# EAGLE design Pi_Observer (EAGLE 9.4.2)
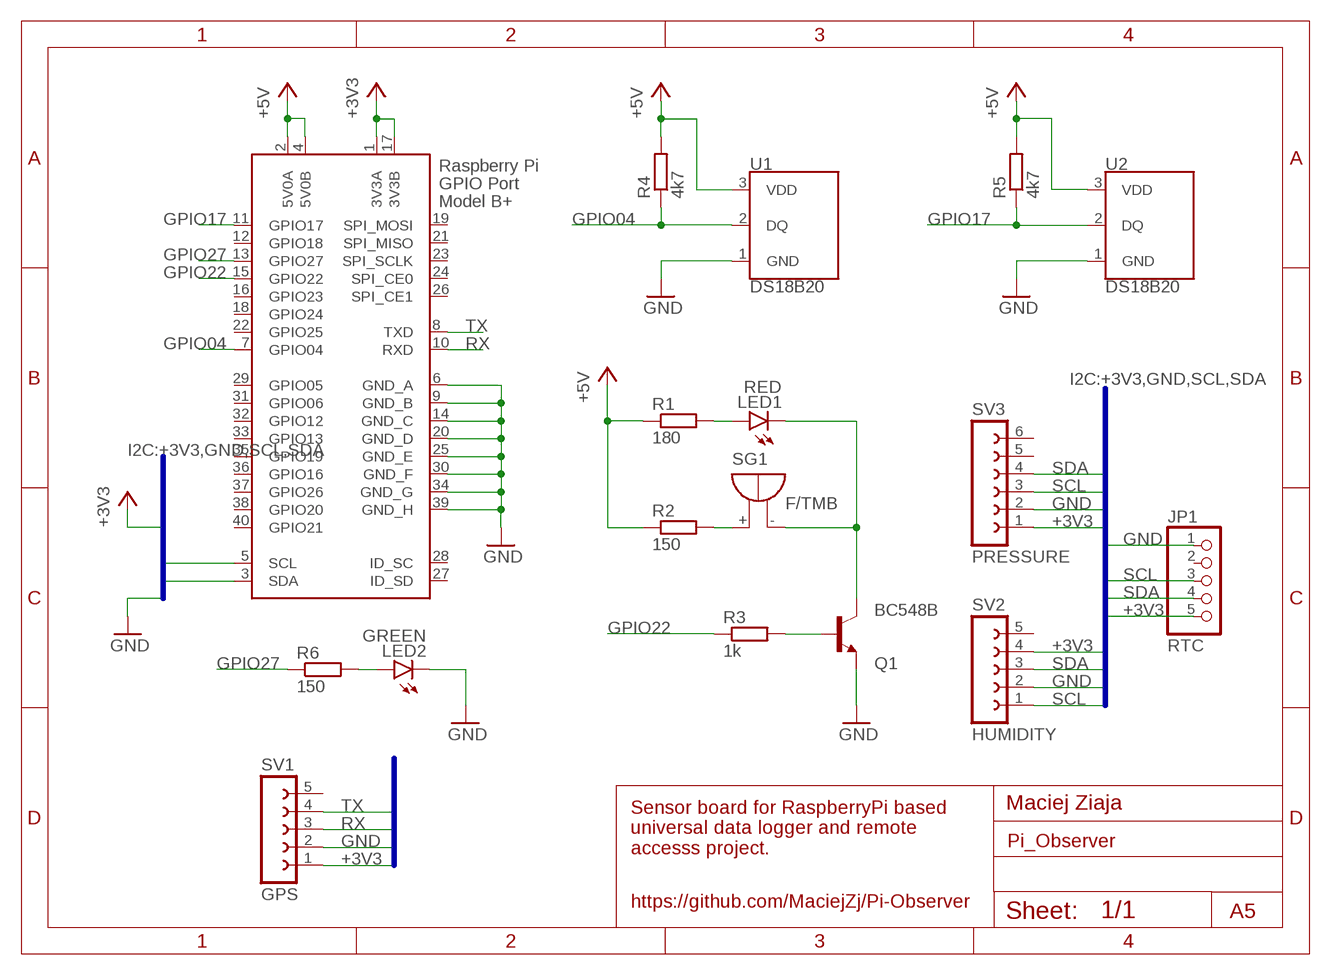
[diagram p0: schematic, sheet 1]

## Parts
JP1  RTC  PINHD-1X5  [1X05]
LED1  RED  LED5MM  [LED5MM]
LED2  GREEN  LED5MM  [LED5MM]
Q1  BC548B  [TO92-EBC]
R1  180  R-EU_M1206  [M1206]
R2  150  R-EU_M1206  [M1206]
R3  1k  R-EU_M1206  [M1206]
R4  4k7  R-EU_M1206  [M1206]
R5  4k7  R-EU_M1206  [M1206]
R6  150  R-EU_M1206  [M1206]
SG1  F/TMB  [F/TMB]
SV1  GPS  FE05-1  [FE05-1]
SV2  HUMIDITY  FE05-1  [FE05-1]
SV3  PRESSURE  FE06-1  [FE06]
U1  DS18B20  [TO-92-AMMO]
U2  DS18B20  [TO-92-AMMO]
X1  RASPI_GPIO_B+#_PIN  [RASPI_GPIO_B+_PIN]

## Nets
+3V3: JP1.5 SV1.1 SV2.4 SV3.1 X1.1(3V3A) X1.17(3V3B)
+5V: R1.1 R2.1 R4.2 R5.2 U1.3(VDD) U2.3(VDD) X1.2(5V0A) X1.4(5V0B)
GND: JP1.1 LED2.K(C) Q1.E SV1.2 SV2.2 SV3.2 U1.1(GND) U2.1(GND) X1.6(GND_A) X1.9(GND_B) X1.14(GND_C) X1.20(GND_D) X1.25(GND_E) X1.30(GND_F) X1.34(GND_G) X1.39(GND_H)
GPIO04: R4.1 U1.2(DQ) X1.7(GPIO04)
GPIO17: R5.1 U2.2(DQ) X1.11(GPIO17)
GPIO22: R3.1 X1.15(GPIO22)
GPIO27: R6.1 X1.13(GPIO27)
N$1: LED1.K(C) Q1.C SG1.-
N$2: R2.2 SG1.+
N$3: LED1.A R1.2
N$5: Q1.B R3.2
N$9: LED2.A R6.2
RX: SV1.3 X1.10(RXD)
SCL: JP1.3 SV2.1 SV3.3 X1.5(SCL)
SDA: JP1.4 SV2.3 SV3.4 X1.3(SDA)
TX: SV1.4 X1.8(TXD)
Unconnected: JP1.2 SV1.5 SV2.5 SV3.5 SV3.6 X1.12(GPIO18) X1.16(GPIO23) X1.18(GPIO24) X1.19(SPI_MOSI) X1.21(SPI_MISO) X1.22(GPIO25) X1.23(SPI_SCLK) X1.24(SPI_CE0) X1.26(SPI_CE1) X1.27(ID_SD) X1.28(ID_SC) X1.29(GPIO05) X1.31(GPIO06) X1.32(GPIO12) X1.33(GPIO13) X1.35(GPIO19) X1.36(GPIO16) X1.37(GPIO26) X1.38(GPIO20) X1.40(GPIO21)

## Buses
I2C:+3V3,GND,SCL,SDA
UART:+3V3,GND,RX,TX

## Notes on the sheet
- Maciej Ziaja
- Sensor board for RaspberryPi based
  universal data logger and remote
  accesss project.
- https://github.com/MaciejZj/Pi-Observer
- A5

## Library data of the parts
JP1 = pinhead:PINHD-1X5: PIN HEADER
LED1 LED2 = led:LED: LED OSRAM: - CHIPLED LG R971, LG N971, LY N971, LG Q971, LY Q971, LO R971, LY R971 LH N974, LH R974 LS Q976, LO Q976, LY Q976 LO Q996 - Hyper CHIPLED LW Q18S LB Q993, LB Q99A, LB R99A - SideLED LS A670, LO A670, LY A670, LG A670, LP A670 LB A673, LV A673, LT A673, LW A673 LH A674 LY A675 LS A676, LA A676, LO A676, LY A676, LW A676 LS A679, LY A679, LG A679 - Hyper Micro SIDELED® LS Y876, LA Y876, LO Y876, LY Y876 LT Y87S - SmartLED LW L88C, LW L88S LB L89C, LB L89S, LG L890 LS L89K, LO L89K, LY L89K LS L896, LA L896, LO L896, LY L896 - TOPLED LS T670, LO T670, LY T670, LG T670, LP T670 LSG T670, LSP T670, LSY T670, LOP T670, LYG T670 LG T671, LOG T671, LSG T671 LB T673, LV T673, LT T673, LW T673 LH T674 LS T676, LA T676, LO T676, LY T676, LB T676, LH T676, LSB T676, LW T676 LB T67C, LV T67C, LT T67C, LS T67K, LO T67K, LY T67K, LW E67C LS E67B, LA E67B, LO E67B, LY E67B, LB E67C, LV E67C, LT E67C LW T67C LS T679, LY T679, LG T679 LS T770, LO T770, LY T770, LG T770, LP T770 LB T773, LV T773, LT T773, LW T773 LH T774 LS E675, LA E675, LY E675, LS T675 LS T776, LA T776, LO T776, LY T776, LB T776 LHGB T686 LT T68C, LB T68C - Hyper Mini TOPLED® LB M676 - Mini TOPLED Santana® LG M470 LS M47K, LO M47K, LY M47K Source: http://www.osram.convergy.de LUXEON: - LUMILED® LXK2-PW12-R00, LXK2-PW12-S00, LXK2-PW14-U00, LXK2-PW14-V00 LXK2-PM12-R00, LXK2-PM12-S00, LXK2-PM14-U00 LXK2-PE12-Q00, LXK2-PE12-R00, LXK2-PE12-S00, LXK2-PE14-T00, LXK2-PE14-U00 LXK2-PB12-K00, LXK2-PB12-L00, LXK2-PB12-M00, LXK2-PB14-N00, LXK2-PB14-P00, LXK2-PB14-Q00 LXK2-PR12-L00, LXK2-PR12-M00, LXK2-PR14-Q00, LXK2-PR14-R00 LXK2-PD12-Q00, LXK2-PD12-R00, LXK2-PD12-S00 LXK2-PH12-R00, LXK2-PH12-S00 LXK2-PL12-P00, LXK2-PL12-Q00, LXK2-PL12-R00 Source: www.luxeon.com KINGBRIGHT: KA-3528ASYC Source: www.kingbright.com
Q1 = transistor-npn:BC548*: NPN Transistor
R1-R6 = rcl:R-EU_: RESISTOR, European symbol; SPICEPREFIX: R
SG1 = buzzer:F/TMB: BUZZER Source: Buerklin; OC_FARNELL: unknown; OC_NEWARK: unknown
SV1 SV2 = con-lsta:FE05-1: FEMALE HEADER; OC_FARNELL: unknown; OC_NEWARK: unknown
SV3 = con-lsta:FE06-1: FEMALE HEADER; OC_FARNELL: unknown; OC_NEWARK: unknown
U1 U2 = SparkFun-Sensors:DS18B20: Dallas/Maxim DS18B20 1-Wire Temperature Sensor The DS18B20 reports degrees C with 9 to 12-bit precision, -55C to 125C (+/-0.5C). Each sensor has a unique 64-Bit Serial number etched into it - allows for a huge number of sensors to be used on one data bus. Datasheet <http://datasheets.maximintegrated.com/en/ds/DS18B20.pdf> SparkFun Products One Wire Digital Temperature Sensor - DS18B20 <https://www.sparkfun.com/products/245> (SEN-00245); STORE_ID: SEN-00245
X1 = raspberrypi_bastelstube_v13:RASPI_GPIO_B+#: 2x20 header connector, all pins connected

## Board
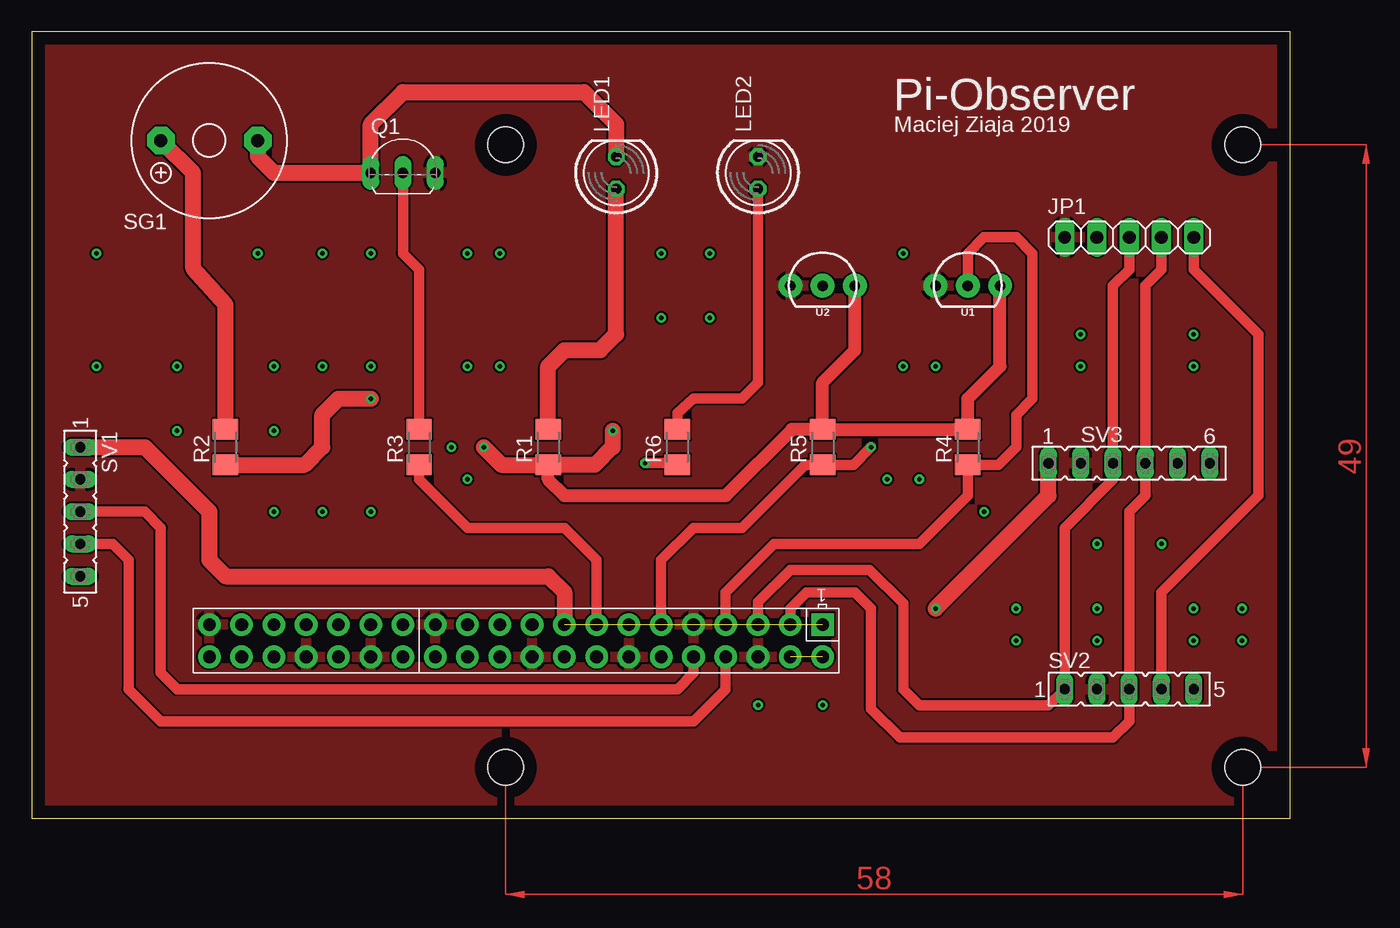
[diagram p1: board, top side]
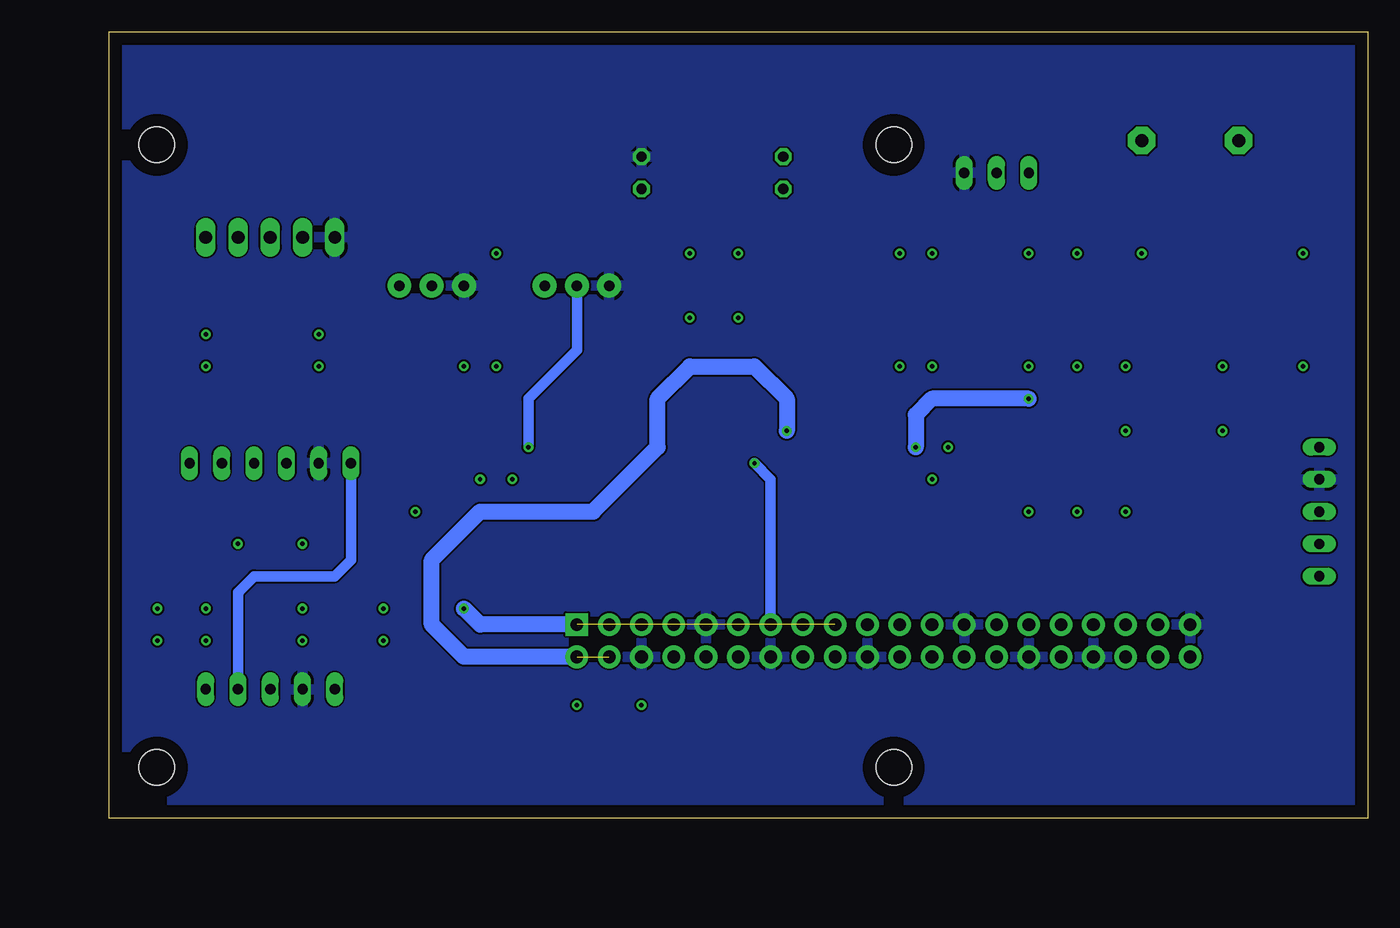
[diagram p2: board, bottom side, seen from below]

Size 99.04 x 61.9 mm. Coordinates in mm from the lower left corner, seen from the top.
Outline: 0,0 99.04,0 99.04,61.9 0,61.9 0,0
Copper layers (1*16): Top 0.035mm / dielectric 1.5mm / Bottom 0.035mm
Design rules "default": minimum track width 6mil, minimum drill 0.35mm, track to track 6mil, track to pad 6mil, pad to pad 6mil, via to via 6mil, smd to smd 6mil, copper to edge 40mil, drill to drill 6mil, minimum pad ring 10mil, minimum via ring 8mil, stop-mask expansion 4mil, vias tented up to drill 0mil, thermal gap 10mil
Holes 2.8 mm at 95.29,4 37.29,4 95.29,53 37.29,53

### Footprints (pad centres in the part's own frame; a part is rotated, then mirrored left to right if it is on the bottom)
1X05 = drill 1.016 long: 1 -5.08,0; 2 -2.54,0; 3 0,0; 4 2.54,0; 5 5.08,0
LED5MM = drill 0.813 octagon: A -1.27,0; K 1.27,0
TO92-EBC = drill 0.813 long: B 0,-1.27; C -2.54,-1.27; E 2.54,-1.27
M1206 = smd 1.6 x 2: 1 -1.4,0; 2 1.4,0
F/TMB = drill 1.016 pad 2.159 octagon: + 3.81,0; - -3.81,0
FE05-1 = drill 0.813 long: 1 -5.08,0; 2 -2.54,0; 3 0,0; 4 2.54,0; 5 5.08,0
FE06 = drill 0.813 long: 1 -6.35,0; 2 -3.81,0; 3 -1.27,0; 4 1.27,0; 5 3.81,0; 6 6.35,0
TO-92-AMMO = drill 0.813 pad 1.88: 1 -2.54,0; 2 0,0; 3 2.54,0
RASPI_GPIO_B+_PIN = drill 1 pad 1.778 square: 1 -24.13,-1.27 | drill 1 pad 1.778: 2 -24.13,1.27; 3 -21.59,-1.27; 4 -21.59,1.27; 5 -19.05,-1.27; 6 -19.05,1.27; 7 -16.51,-1.27; 8 -16.51,1.27; 9 -13.97,-1.27; 10 -13.97,1.27; 11 -11.43,-1.27; 12 -11.43,1.27; 13 -8.89,-1.27; 14 -8.89,1.27; 15 -6.35,-1.27; 16 -6.35,1.27; 17 -3.81,-1.27; 18 -3.81,1.27; 19 -1.27,-1.27; 20 -1.27,1.27; 21 1.27,-1.27; 22 1.27,1.27; 23 3.81,-1.27; 24 3.81,1.27; 25 6.35,-1.27; 26 6.35,1.27; 27 8.89,-1.27; 28 8.89,1.27; 29 11.43,-1.27; 30 11.43,1.27; 31 13.97,-1.27; 32 13.97,1.27; 33 16.51,-1.27; 34 16.51,1.27; 35 19.05,-1.27; 36 19.05,1.27; 37 21.59,-1.27; 38 21.59,1.27; 39 24.13,-1.27; 40 24.13,1.27

### Placement (x,y rotation side)
JP1  86.36,45.72 0 top
LED1  45.99,50.8 90 top
LED2  57.15,50.8 90 top
Q1  29.21,52.07 0 top
R1  40.64,29.21 90 top
R2  15.24,29.21 90 top
R3  30.48,29.21 90 top
R4  73.66,29.21 90 top
R5  62.23,29.21 90 top
R6  50.8,29.21 90 top
SG1  13.97,53.34 180 top
SV1  3.81,24.13 270 top
SV2  86.36,10.16 0 top
SV3  86.36,27.94 0 top
U1  73.66,41.91 0 top
U2  62.23,41.91 0 top
X1  38.1,13.97 180 top

### Tracks (layer width: path | path; a pad name or v marks a point on that pad's centre or on a via)
+3V3  (via drill 0.35)  (1 unrouted)
  Top 0.813: SV2.4 88.9,17.78 96.52,25.4 96.52,38.1 91.44,43.18 JP1.5
  Top 1.27: v71.12,16.51 80.01,25.4 SV3.1 | SV1.1 8.89,29.21 13.97,24.13 13.97,20.32 15.24,19.05 40.64,19.05 41.91,17.78 X1.17
  Bottom 0.813: SV2.4 88.9,17.78 87.63,19.05 81.28,19.05 80.01,20.32 SV3.1
  Bottom 1.27: X1.1 69.85,15.24 v71.12,16.51
+5V  (via drill 0.35)  (1 unrouted)
  Top 0.813: R1.1 40.77,27.94
  Top 1.016: R5.2 62.23,34.29 64.77,36.83 U2.3 | U1.3 76.2,35.56 73.66,33.02 R4.2 R5.2 | R5.2 59.82,30.61 54.61,25.4 41.91,25.4 40.64,26.67 R1.1
  Top 1.27: R2.1 21.46,27.81 22.86,29.21 22.86,31.75 24.13,33.02 v26.67,33.02 | v35.56,29.21 36.96,27.81 R1.1 44.32,27.81 45.72,29.21 v45.72,30.48
  Bottom 1.27: v35.56,29.21 35.56,31.75 34.29,33.02 v26.67,33.02 | X1.2 71.12,12.7 73.66,15.24 73.66,20.32 69.85,24.13 60.96,24.13 55.88,29.21 55.88,33.02 53.34,35.56 48.26,35.56 45.72,33.02 v45.72,30.48
GND
  pour Top: -1.27,63.5 -1.27,-1.27 100.33,-1.27 100.33,63.5
  pour Bottom: -1.27,63.5 -1.27,-1.27 100.33,-1.27 100.33,63.5
GPIO04
  Top 0.813: U1.2 73.66,44.45 74.93,45.72 77.47,45.72 78.74,44.45 78.74,33.02 77.47,31.75 77.47,29.21 76.07,27.81 R4.1 73.66,25.4 69.85,21.59 58.42,21.59 54.61,17.78 X1.7
GPIO17  (via drill 0.35)
  Top 0.813: X1.11 49.53,20.32 52.07,22.86 55.88,22.86 60.83,27.81 R5.1 64.64,27.81 v66.04,29.21
  Bottom 0.813: U2.2 62.23,36.83 66.04,33.02 v66.04,29.21
GPIO22
  Top 0.813: 30.35,27.94 R3.1 30.48,26.67 34.29,22.86 41.91,22.86 44.45,20.32 X1.15
GPIO27  (via drill 0.35)
  Top 0.813: R6.1 50.67,27.94 v48.26,27.94
  Bottom 0.813: v48.26,27.94 46.99,26.67 X1.13
N$1
  Top 1.27: LED1.K 45.99,54.61 43.45,57.15 29.21,57.15 26.67,54.61 Q1.C 19.05,50.8 17.78,52.07 SG1.-
N$2
  Top 1.27: SG1.+ 12.7,50.8 12.7,43.26 15.24,40.41 R2.2
N$3
  Top 1.27: R1.2 40.64,35.56 41.91,36.83 44.72,36.83 45.99,38.1 LED1.A
N$4  (via drill 0.35)
  other vias: 19.05,35.56
N$5
  Top 0.813: Q1.B 29.21,44.45 30.48,43.18 R3.2
N$6  (via drill 0.35)
  other vias: 22.86,35.56
N$7  (via drill 0.35)
  other vias: 26.67,35.56
N$8  (via drill 0.35)
  other vias: 34.29,35.56
N$9
  Top 0.813: R6.2 50.8,31.88 52.07,33.02 55.88,33.02 57.15,34.29 LED2.A
N$10  (via drill 0.35)
  other vias: 36.83,35.56
N$11  (via drill 0.35)
  other vias: 49.53,44.45
N$12  (via drill 0.35)
  other vias: 53.34,44.45
N$13  (via drill 0.35)
  other vias: 49.53,39.37
N$14  (via drill 0.35)
  other vias: 53.34,39.37
N$15  (via drill 0.35)
  other vias: 11.43,35.56
N$16  (via drill 0.35)
  other vias: 36.83,44.45
N$17  (via drill 0.35)
  other vias: 34.29,44.45
N$18  (via drill 0.35)
  other vias: 19.05,24.13
N$19  (via drill 0.35)
  other vias: 22.86,24.13
N$20  (via drill 0.35)
  other vias: 26.67,24.13
N$21  (via drill 0.35)
  other vias: 33.02,29.21
N$22  (via drill 0.35)
  other vias: 11.43,30.48
N$23  (via drill 0.35)
  other vias: 26.67,44.45
N$24  (via drill 0.35)
  other vias: 22.86,44.45
N$25  (via drill 0.35)
  other vias: 17.78,44.45
N$26  (via drill 0.35)
  other vias: 34.29,26.67
N$27  (via drill 0.35)
  other vias: 68.58,35.56
N$28  (via drill 0.35)
  other vias: 71.12,35.56
N$29  (via drill 0.35)
  other vias: 57.15,8.89
N$30  (via drill 0.35)
  other vias: 62.23,8.89
N$31  (via drill 0.35)
  other vias: 83.82,21.59
N$32  (via drill 0.35)
  other vias: 77.47,16.51
N$33  (via drill 0.35)
  other vias: 77.47,13.97
N$34  (via drill 0.35)
  other vias: 83.82,16.51
N$35  (via drill 0.35)
  other vias: 82.55,35.56
N$36  (via drill 0.35)
  other vias: 82.55,38.1
N$37  (via drill 0.35)
  other vias: 83.82,13.97
N$38  (via drill 0.35)
  other vias: 91.44,35.56
N$39  (via drill 0.35)
  other vias: 88.9,21.59
N$40  (via drill 0.35)
  other vias: 91.44,16.51
N$41  (via drill 0.35)
  other vias: 91.44,13.97
N$42  (via drill 0.35)
  other vias: 95.25,16.51
N$43  (via drill 0.35)
  other vias: 95.25,13.97
N$44  (via drill 0.35)
  other vias: 67.31,26.67
N$45  (via drill 0.35)
  other vias: 69.85,26.67
N$46  (via drill 0.35)
  other vias: 74.93,24.13
N$47  (via drill 0.35)
  other vias: 5.08,35.56
N$48  (via drill 0.35)
  other vias: 5.08,44.45
N$49  (via drill 0.35)
  other vias: 68.58,44.45
N$53  (via drill 0.35)
  other vias: 91.44,38.1
N$63  (via drill 0.35)
  other vias: 19.05,30.48
RX
  Top 0.813: X1.10 52.07,11.43 50.8,10.16 11.43,10.16 10.16,11.43 10.16,22.86 8.89,24.13 SV1.3
SCL
  Top 0.813: JP1.3 86.36,43.18 85.09,41.91 SV3.3 85.09,26.67 81.28,22.86 SV2.1 80.01,8.89 69.85,8.89 68.58,10.16 68.58,16.89 65.91,19.56 59.69,19.56 57.15,17.02 X1.5
SDA
  Top 0.813: JP1.4 88.9,43.18 87.63,41.91 SV3.4 87.63,25.4 86.36,24.13 SV2.3 86.36,7.62 85.09,6.35 68.31,6.35 66.04,8.62 66.04,16.51 64.77,17.78 60.96,17.78 59.69,16.51 X1.3
TX
  Top 0.813: SV1.4 6.35,21.59 7.62,20.32 7.62,10.16 10.16,7.62 52.07,7.62 54.61,10.16 X1.8
(copper drawn outside any net)
  shapes: Top area x2

### Text on the board
tPlace: Pi-Observer | Maciej Ziaja 2019